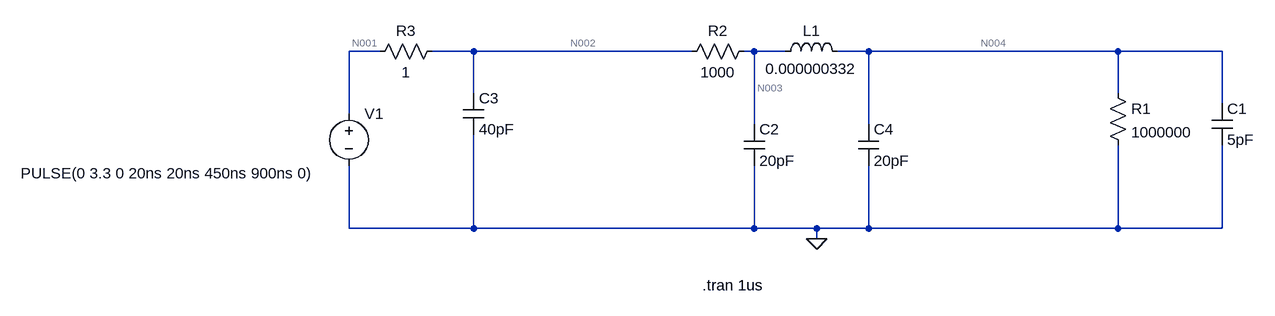
[diagram p0: schematic Draft2.asc]
Draft2.asc, the LTspice schematic file:
Version 4
SHEET 1 1000 680
WIRE -832 48 -880 48
WIRE -688 48 -752 48
WIRE -352 48 -688 48
WIRE -256 48 -272 48
WIRE -208 48 -256 48
WIRE -80 48 -128 48
WIRE 304 48 -80 48
WIRE 464 48 304 48
WIRE -688 112 -688 48
WIRE 304 112 304 48
WIRE 464 128 464 48
WIRE -880 144 -880 48
WIRE -256 160 -256 48
WIRE -80 160 -80 48
WIRE -880 320 -880 224
WIRE -688 320 -688 176
WIRE -688 320 -880 320
WIRE -256 320 -256 224
WIRE -256 320 -688 320
WIRE -160 320 -256 320
WIRE -80 320 -80 224
WIRE -80 320 -160 320
WIRE 304 320 304 192
WIRE 304 320 -80 320
WIRE 464 320 464 192
WIRE 464 320 304 320
WIRE -160 336 -160 320
FLAG -160 336 0
SYMBOL cap 448 128 R0
SYMATTR InstName C1
SYMATTR Value 5pF
SYMBOL res 288 96 R0
SYMATTR InstName R1
SYMATTR Value 1000000
SYMBOL ind -224 64 R270
WINDOW 0 32 56 VTop 2
WINDOW 3 5 56 VBottom 2
SYMATTR InstName L1
SYMATTR Value 0.000000332
SYMBOL res -256 32 R90
WINDOW 0 0 56 VBottom 2
WINDOW 3 32 56 VTop 2
SYMATTR InstName R2
SYMATTR Value 1000
SYMBOL voltage -880 128 R0
WINDOW 3 -505 107 Left 2
WINDOW 123 0 0 Left 0
WINDOW 39 0 0 Left 0
SYMATTR Value PULSE(0 3.3 0 20ns 20ns 450ns 900ns 0)
SYMATTR InstName V1
SYMBOL cap -704 112 R0
SYMATTR InstName C3
SYMATTR Value 40pF
SYMBOL res -736 32 R90
WINDOW 0 0 56 VBottom 2
WINDOW 3 32 56 VTop 2
SYMATTR InstName R3
SYMATTR Value 1
SYMBOL cap -96 160 R0
SYMATTR InstName C4
SYMATTR Value 20pF
SYMBOL cap -272 160 R0
SYMATTR InstName C2
SYMATTR Value 20pF
TEXT -336 408 Left 2 !.tran 1us

The netlist it stands for:
* Draft2.asc
C1 N004 0 5pF
R1 N004 0 1000000
L1 N003 N004 0.000000332
R2 N003 N002 1000
V1 N001 0 PULSE(0 3.3 0 20ns 20ns 450ns 900ns 0)
C3 N002 0 40pF
R3 N002 N001 1
C4 N004 0 20pF
C2 N003 0 20pF
.tran 1us
.backanno
.end

* Results of the author's LTspice run, read from the files saved beside the schematic
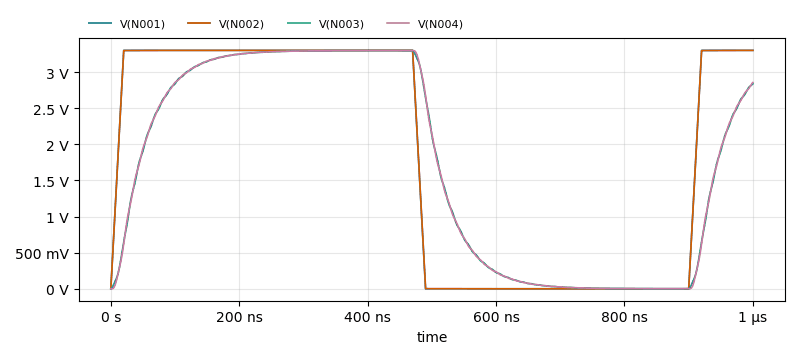
[diagram p1: Transient Analysis of Draft2.asc, plotted from the saved traces]
* Transient Analysis, 1 run:
*   V(N001): min 0 V, max 3.3 V, average 1.848 V, rms 2.447 V, last 3.3 V
*   V(N002): min 0 V, max 3.3 V, average 1.848 V, rms 2.447 V, last 3.3 V
*   V(N003): min 0 V, max 3.297 V, average 1.718 V, rms 2.231 V, last 2.837 V
*   V(N004): min 0 V, max 3.297 V, average 1.718 V, rms 2.233 V, last 2.856 V